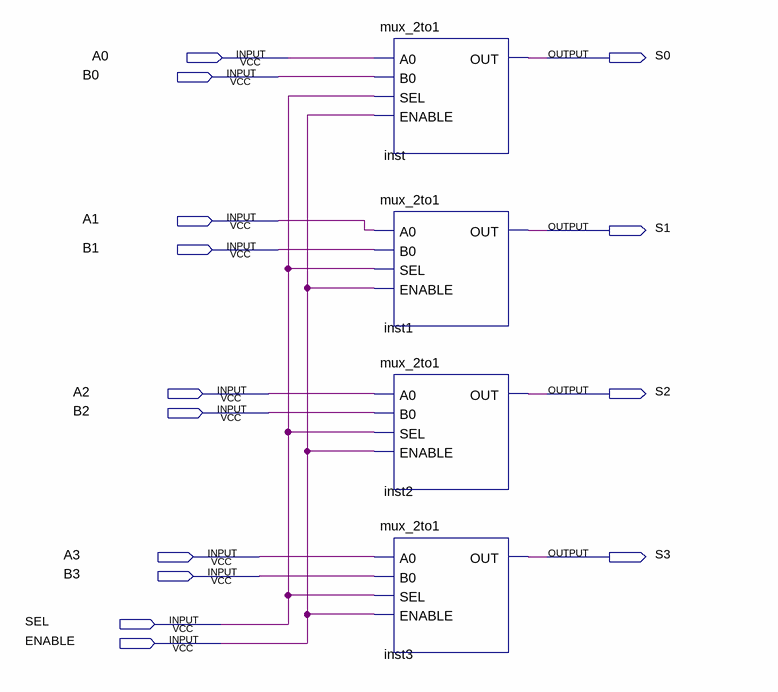
[diagram p0: schematic sheet]
// Quartus schematic mux_2to1_4bit.bdf as structural Verilog: 4 symbols, 14 pins
module mux_2to1_4bit (
  input  A0,
  input  B0,
  input  A1,
  input  B1,
  input  A2,
  input  B2,
  input  A3,
  input  B3,
  input  SEL,
  input  ENABLE,
  output S0,
  output S1,
  output S2,
  output S3
);

  mux_2to1 inst (.A0(A0), .B0(B0), .SEL(SEL), .ENABLE(ENABLE), .OUT(S0));
  mux_2to1 inst1 (.A0(A1), .B0(B1), .SEL(SEL), .ENABLE(ENABLE), .OUT(S1));
  mux_2to1 inst2 (.A0(A2), .B0(B2), .SEL(SEL), .ENABLE(ENABLE), .OUT(S2));
  mux_2to1 inst3 (.A0(A3), .B0(B3), .SEL(SEL), .ENABLE(ENABLE), .OUT(S3));
endmodule
